# EAGLE design ultrasonic_detector (EAGLE 8.5.2)
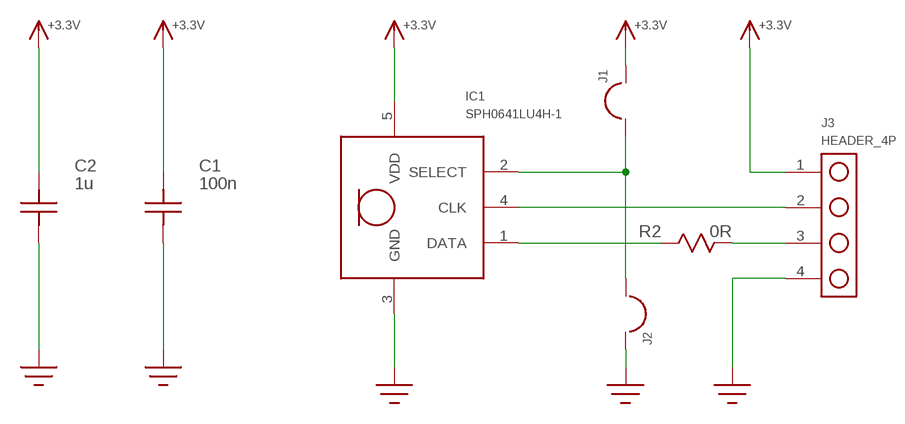
[diagram p0: schematic, sheet 1]

## Parts
C1  100n  C0603  [C0603]
C2  1u  C0603  [C0603]
IC1  SPH0641LU4H-1  [SPH0641LU4H-1]
J1  SOLDER_BRIDGE  [SOLDER_BRIDGE]
J2  SOLDER_BRIDGE  [SOLDER_BRIDGE]
J3  HEADER_4P  [HEADER_4P]
R2  0R  R0603  [R0603]

## Nets
+3.3V: C1.P$2 C2.P$2 IC1.5(VDD) J1.2@1 J1.2@2 J1.2@3 J3.1
GND: C1.P$1 C2.P$1 IC1.3(GND) J2.2@1 J2.2@2 J2.2@3 J3.4
N$1: IC1.2(SELECT) J1.1 J2.1
N$2: IC1.4(CLK) J3.2
N$3: IC1.1(DATA) R2.P$1
N$5: J3.3 R2.P$2

## Library data of the parts
C1 C2 = ultrasonic-detector:C
IC1 = ultrasonic-detector:SPH0641LU4H-1
J1 J2 = ultrasonic-detector:SOLDER_BRIDGE
J3 = ultrasonic-detector:HEADER_4P
R2 = ultrasonic-detector:R

## Board
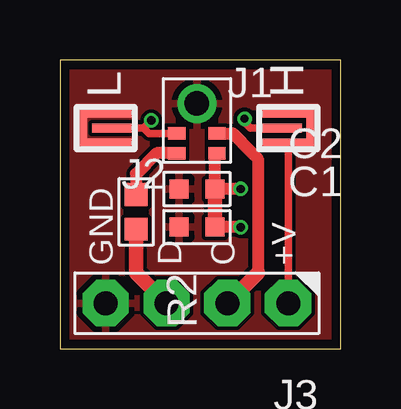
[diagram p1: board, top side]
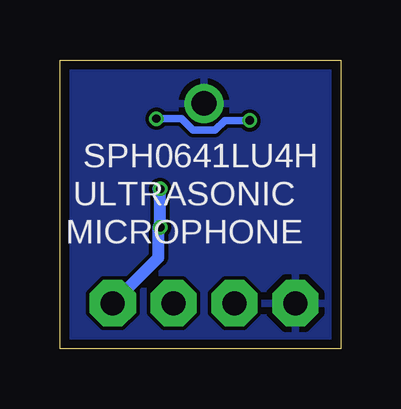
[diagram p2: board, bottom side, seen from below]

Size 11.73 x 12.05 mm. Coordinates in mm from the lower left corner, seen from the top.
Outline: 0,0 11.73,0 11.73,12.05 0,12.05 0,0
Copper layers (1*16): Top 0.035559375mm / dielectric 1.6mm / Bottom 0.035559375mm
Design rules "oshpark-2layer": minimum track width 6mil, minimum drill 10mil, track to track 6mil, track to pad 6mil, pad to pad 6mil, via to via 6mil, smd to smd 6mil, copper to edge 15mil, drill to drill 6mil, minimum pad ring 5mil, minimum via ring 5mil, stop-mask expansion 2.5mil, vias tented up to drill 0mil, thermal gap 10mil

### Footprints (pad centres in the part's own frame; a part is rotated, then mirrored left to right if it is on the bottom)
C0603 = smd 0.8 x 0.8: P$1 -0.75,0; P$2 0.75,0
SPH0641LU4H-1 = smd 0.725 x 0.522: 1 0.838,0.411; 2 0.838,-0.411; 4 -0.838,-0.411; 5 -0.838,0.411 | drill 1.025 pad 1.625: 3 0,-1.663
SOLDER_BRIDGE = smd 1.778 x 0.381: 1 0,0 | smd 0.381 x 1.27: 2@1 1.27,0 | smd 2.286 x 0.381: 2@2 0.318,0.635; 2@3 0.318,-0.635
HEADER_4P = drill 1 pad 1.93 octagon: 1 -3.81,0; 2 -1.27,0; 3 1.27,0; 4 3.81,0
R0603 = smd 0.95 x 0.95: P$1 -0.725,0; P$2 0.725,0

### Placement (x,y rotation side)
C1  5.71,5.08 0 top
C2  5.71,6.67 0 top
IC1  5.71,8.57 180 top
J1  9.21,9.21 0 top
J2  2.22,9.21 180 top
J3  5.71,1.91 180 top
R2  3.17,5.71 270 top

### Tracks (layer width: path | path; a pad name or v marks a point on that pad's centre or on a via)
+3.3V  (via drill 0.35)
  Top 0.152: J1.2@2 10.48,9.84 J1.2@1 10.48,8.57 J1.2@3
  Top 0.305: J1.2@3 J3.1
  Top 0.508: IC1.5 6.46,8.16 C2.P$2 v7.55,6.67 | v7.55,5.08 C1.P$2
  Top 0.61: C1.P$2 C2.P$2
  Bottom 0.508: J3.1 7.62,3.81 7.62,5.08 v7.55,5.08 7.55,6.59 7.62,6.67 v7.55,6.67
GND
  pour Top: 0,0 11.75,0 11.75,12.06 0,12.06
  pour Bottom: 0,0 0,12.06 11.75,12.06 11.75,0
N$1  (via drill 0.35)
  Top 0.305: IC1.2 3.72,8.98 3.49,9.21 | 3.49,9.21 J2.1 | J1.1 7.94,9.21 7.62,9.53 v7.7,9.6 | v3.81,9.53 3.49,9.21
  Bottom 0.305: v7.7,9.6 6.66,9.6 6.18,9.12 5.25,9.12 4.84,9.53 v3.81,9.53
N$2
  Top 0.508: IC1.4 7.21,8.98 7.98,8.22 7.98,8.21 8.26,7.93 8.26,3.17
  Top 0.61: 8.26,3.17 J3.2
N$3
  Top 0.508: IC1.1 4.03,8.16 3.17,7.3 R2.P$1
N$5
  Top 0.61: J3.3 3.17,3.17 R2.P$2

### Text on the board
tPlace: L | H | GND | D | C | +V
bPlace: SPH0641LU4H | ULTRASONIC | MICROPHONE